# Altium schematic sheet MOSFET Driver.SchDoc
size A4
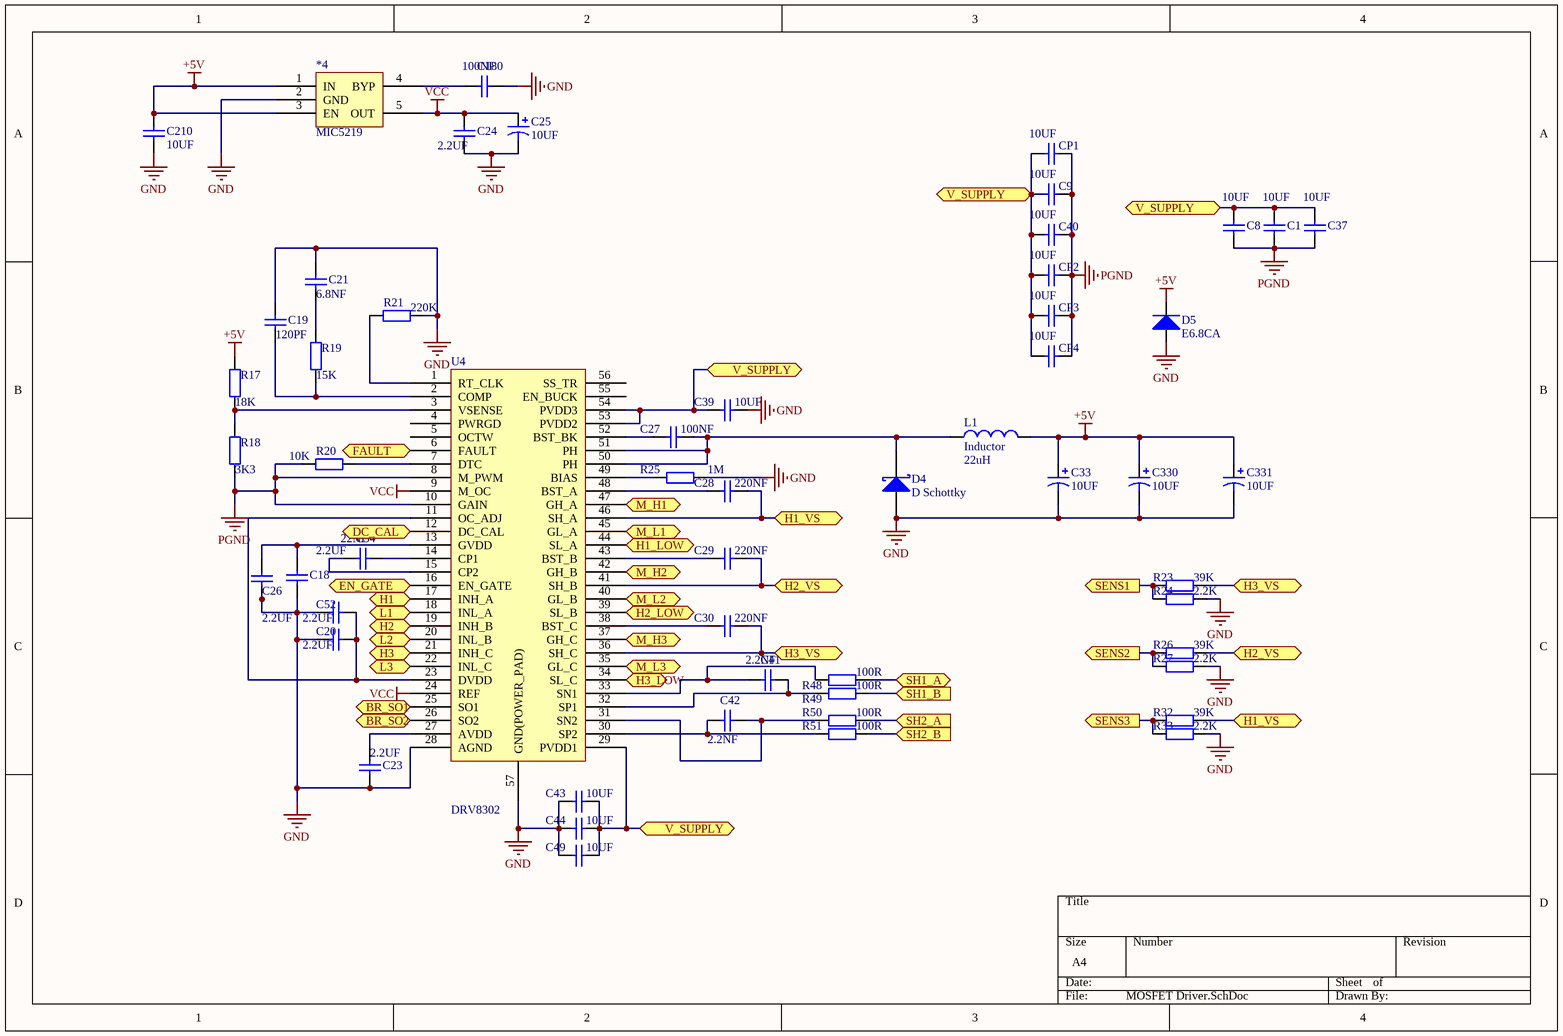
[diagram p0: MOSFET Driver.SchDoc]

## Parts
*4  MIC5219  [SOT23-5]
C1  10UF  [1812]
C8  10UF  [1206]
C9  10UF  [1206]
C18  2.2UF  [C-0603]
C19  120PF  [0402]
C20  2.2UF  [C-0603]
C21  6.8NF  [0402]
C23  2.2UF  [C-0603]
C24  2.2UF  [C-0603]
C25  10UF  [LC-1206]
C26  2.2UF  [C-0603]
C27  100NF  [C-0603]
C28  220NF  [C-0603]
C29  220NF  [C-0603]
C30  220NF  [C-0603]
C33  10UF  [C1206]
C34  22NF  [0402]
C37  10UF  [1812]
C39  10UF  [C1206A]
C40  10UF  [1206]
C41  2.2NF  [0402]
C42  2.2NF  [0402]
C43  10UF  [C1206A]
C44  10UF  [C1206A]
C49  10UF  [C1206A]
C52  2.2UF  [C-0603]
C180  100NF  [C-0603]
C210  10UF  [C-0603]
C330  10UF  [C1206]
C331  10UF  [C1206]
CP1  10UF  [1206]
CP2  10UF  [1206]
CP3  10UF  [1206]
CP4  10UF  [1206]
D4  D Schottky  [LC-SMA(DO-214AC)_S1]
D5  Type: E6.8CA  [DIODE-1206]  (hidden comment: TVS)
L1  Inductor  value 22uH  [L-SMD-7]
R17  18K  [0402]
R18  3K3  [0402]
R19  15K  [0402]
R20  10K  [0402]
R21  220K  [0402]
R23  39K  [0402]
R24  2.2K  [0402]
R25  1M  [0603-2]
R26  39K  [0402]
R27  2.2K  [0402]
R32  39K  [0402]
R33  2.2K  [0402]
R48  100R  [0402]
R49  100R  [0402]
R50  100R  [0402]
R51  100R  [0402]
U4  DRV8302  [HTSSOP-56]

## Ports
BR_SO1, BR_SO2, DC_CAL (in), EN_GATE (in), FAULT (out), H1 (in), H1_LOW, H1_VS, H2 (in), H2_LOW, H2_VS, H3 (in), H3_LOW, H3_VS, L1 (in), L2 (in), L3 (in), M_H1, M_H2, M_H3, M_L1, M_L2, M_L3, SENS1 (out), SENS2 (out), SENS3 (out), SH1_A, SH1_B (in), SH2_A (in), SH2_B (in), V_SUPPLY

## Nets
+5V: *4.1(IN) *4.3(EN) C33.1 C210.1 C330.1 C331.1 D5.2(K) L1.2 R17.2
GND: *4.2(GND) C18.1 C19.1 C20.2 C21.1 C23.2 C24.2 C25.2 C26.1 C33.2 C39.2 C43.2 C44.2 C49.2 C52.2 C180.1 C210.2 C330.2 C331.2 D4.1(A) D5.1(A) R21.1 R24.1 R25.1 R27.1 R33.1 U4.28(AGND) U4.57(GND(POWER_PAD))
PGND: C1.1 C8.1 C9.2 C37.1 C40.2 CP1.2 CP2.2 CP3.2 CP4.2 R18.1 R20.2 U4.8(M_PWM) U4.10(GAIN)
VCC: *4.5(OUT) C24.1 C25.1 U4.9(M_OC) U4.24(REF)
BR_SO1: U4.25(SO1) ; port BR_SO1
BR_SO2: U4.26(SO2) ; port BR_SO2
DC_CAL: U4.12(DC_CAL) ; port DC_CAL
EN_GATE: U4.16(EN_GATE) ; port EN_GATE
FAULT: U4.6(FAULT) ; port FAULT
H1: U4.17(INH_A) ; port H1
H1_LOW: U4.44(SL_A) ; port H1_LOW
H1_VS: C28.2 R32.1 U4.46(SH_A) ; port H1_VS
H2: U4.19(INH_B) ; port H2
H2_LOW: U4.39(SL_B) ; port H2_LOW
H2_VS: C29.2 R26.1 U4.41(SH_B) ; port H2_VS
H3: U4.21(INH_C) ; port H3
H3_LOW: U4.34(SL_C) ; port H3_LOW
H3_VS: C30.2 R23.1 U4.36(SH_C) ; port H3_VS
L1: U4.18(INL_A) ; port L1
L2: U4.20(INL_B) ; port L2
L3: U4.22(INL_C) ; port L3
M_H1: U4.47(GH_A) ; port M_H1
M_H2: U4.42(GH_B) ; port M_H2
M_H3: U4.37(GH_C) ; port M_H3
M_L1: U4.45(GL_A) ; port M_L1
M_L2: U4.40(GL_B) ; port M_L2
M_L3: U4.35(GL_C) ; port M_L3
SENS1: R23.2 R24.2 ; port SENS1
SENS2: R26.2 R27.2 ; port SENS2
SENS3: R32.2 R33.2 ; port SENS3
SH1_A: R48.1 ; port SH1_A
SH1_B: R49.1 ; port SH1_B
SH2_A: R50.1 ; port SH2_A
SH2_B: R51.1 ; port SH2_B
V_SUPPLY: C1.2 C8.2 C9.1 C37.2 C39.1 C40.1 C43.1 C44.1 C49.1 CP1.1 CP2.1 CP3.1 CP4.1 U4.29(PVDD1) U4.53(PVDD2) U4.54(PVDD3) ; port V_SUPPLY
Net*4_4: *4.4(BYP) C180.2
NetC18_2: C18.2 C26.2 U4.13(GVDD)
NetC19_2: C19.2 R19.1 U4.2(COMP)
NetC20_1: C20.1 C52.1 U4.11(OC_ADJ) U4.23(DVDD)
NetC21_2: C21.2 R19.2
NetC23_1: C23.1 U4.27(AVDD)
NetC27_1: C27.1 U4.52(BST_BK)
NetC27_2: C27.2 D4.2(K) L1.1 U4.50(PH) U4.51(PH)
NetC28_1: C28.1 U4.48(BST_A)
NetC29_1: C29.1 U4.43(BST_B)
NetC30_1: C30.1 U4.38(BST_C)
NetC34_1: C34.1 U4.15(CP2)
NetC34_2: C34.2 U4.14(CP1)
NetC41_1: C41.1 R48.2 U4.33(SN1)
NetC41_2: C41.2 R49.2 U4.32(SP1)
NetC42_1: C42.1 R51.2 U4.30(SP2)
NetC42_2: C42.2 R50.2 U4.31(SN2)
NetR17_1: R17.1 R18.2 U4.3(VSENSE)
NetR20_1: R20.1 U4.7(DTC)
NetR21_2: R21.2 U4.1(RT_CLK)
NetR25_2: R25.2 U4.49(BIAS)

Not connected (* = marked no-connect by the designer): U4 4(PWRGD) 5(OCTW) 55(EN_BUCK) 56(SS_TR)

## Library data of the parts
C1 C37 = CAP: Capacitor; Value: 47u; Published: 8-Jun-2000; Revision: July-2002: Re-released for DXP Platform.; Publisher: Altium Limited
C8 C9 C39 C40 C43 C44 C49 CP1-CP4 = CAP: Capacitor; Value: 10u; Published: 8-Jun-2000; Revision: July-2002: Re-released for DXP Platform.; Publisher: Altium Limited
C18 C20 C23 C24 C26 C52 = CAP: Capacitor; Value: 2.2u; Published: 8-Jun-2000; Revision: July-2002: Re-released for DXP Platform.; Publisher: Altium Limited
C19 = CAP: Capacitor; Value: 120p; Published: 8-Jun-2000; Revision: July-2002: Re-released for DXP Platform.; Publisher: Altium Limited
C21 = CAP: Capacitor; Value: 6.8n; Published: 8-Jun-2000; Revision: July-2002: Re-released for DXP Platform.; Publisher: Altium Limited
C25 C33 C330 C331 = Cap Pol1: Polarized Capacitor (Radial); Value: 100u; Published: 8-Jun-2000; LatestRevisionDate: 17-Jul-2002; LatestRevisionNote: Re-released for DXP Platform.; PackageReference: RB7.6-15; Publisher: Altium Limited; PackageDescription: Polarized Capacitor (Radial); 2 Leads
C27 C180 C210 = CAP: Capacitor; Published: 8-Jun-2000; Revision: July-2002: Re-released for DXP Platform.; Publisher: Altium Limited
  C27: Value: 100nf
  C180: Value: 100nF
  C210: Value: 10UF
C28-C30 = CAP: Capacitor; Value: 220n; Published: 8-Jun-2000; Revision: July-2002: Re-released for DXP Platform.; Publisher: Altium Limited
C34 = CAP: Capacitor; Value: 22n; Published: 8-Jun-2000; Revision: July-2002: Re-released for DXP Platform.; Publisher: Altium Limited
C41 C42 = CAP: Capacitor; Value: 2.2n; Published: 8-Jun-2000; Revision: July-2002: Re-released for DXP Platform.; Publisher: Altium Limited
D4 = D Schottky: Schottky Diode; Published: 8-Jun-2000; LatestRevisionDate: 17-Jul-2002; LatestRevisionNote: Re-released for DXP Platform.; PackageReference: SMB; Publisher: Altium Limited; PackageDescription: DO-214-AA/SMB; 2 C-Bend Leads; Body 5.3 x 3.6 mm, inc. leads (LxW); Code_JEDEC: DO-214-AA
D5 = TVS: TVS保护; Published: 8-Jun-2000; LatestRevisionDate: 17-Jul-2002; LatestRevisionNote: Re-released for DXP Platform.; PackageDocument: Sep-1996; PackageReference: SMC; Publisher: Altium Limited; Code_JEDEC: DO-214-AB
L1 = Inductor: Code_IEC: 1005; Published: 8-Jun-2000; LatestRevisionDate: 29-May-2009; LatestRevisionNote: IPC-7351 Footprint Added.; PackageReference: 0402-A; Publisher: Altium Limited; PackageDescription: Chip Inductor; Code_JEITA: 0402
R17-R21 R23 R25 R26 R32 R48-R51 = Res1: 贴片电阻; Published: 8-Jun-2000; LatestRevisionDate: 17-Jul-2002; LatestRevisionNote: Re-released for DXP Platform.; PackageReference: AXIAL-0.4; Publisher: Altium Limited
  R17: Value: 18k
  R18: Value: 3k3
  R19: Value: 15k
  R20: Value: 10K
  R21: Value: 220k
  R23 R26 R32: Value: 39k
  R25: Value: 1M
  R48-R51: Value: 100R
R24 R27 R33 = Res1: 贴片电阻; Value: 2k2; Published: 8-Jun-2000; LatestRevisionDate: 17-Jul-2002; LatestRevisionNote: Re-released for DXP Platform.; PackageReference: AXIAL-0.4; Publisher: Altium Limited
U4 = DRV8302: 无刷直流驱动器